# EAGLE design board (EAGLE 6.6.0)
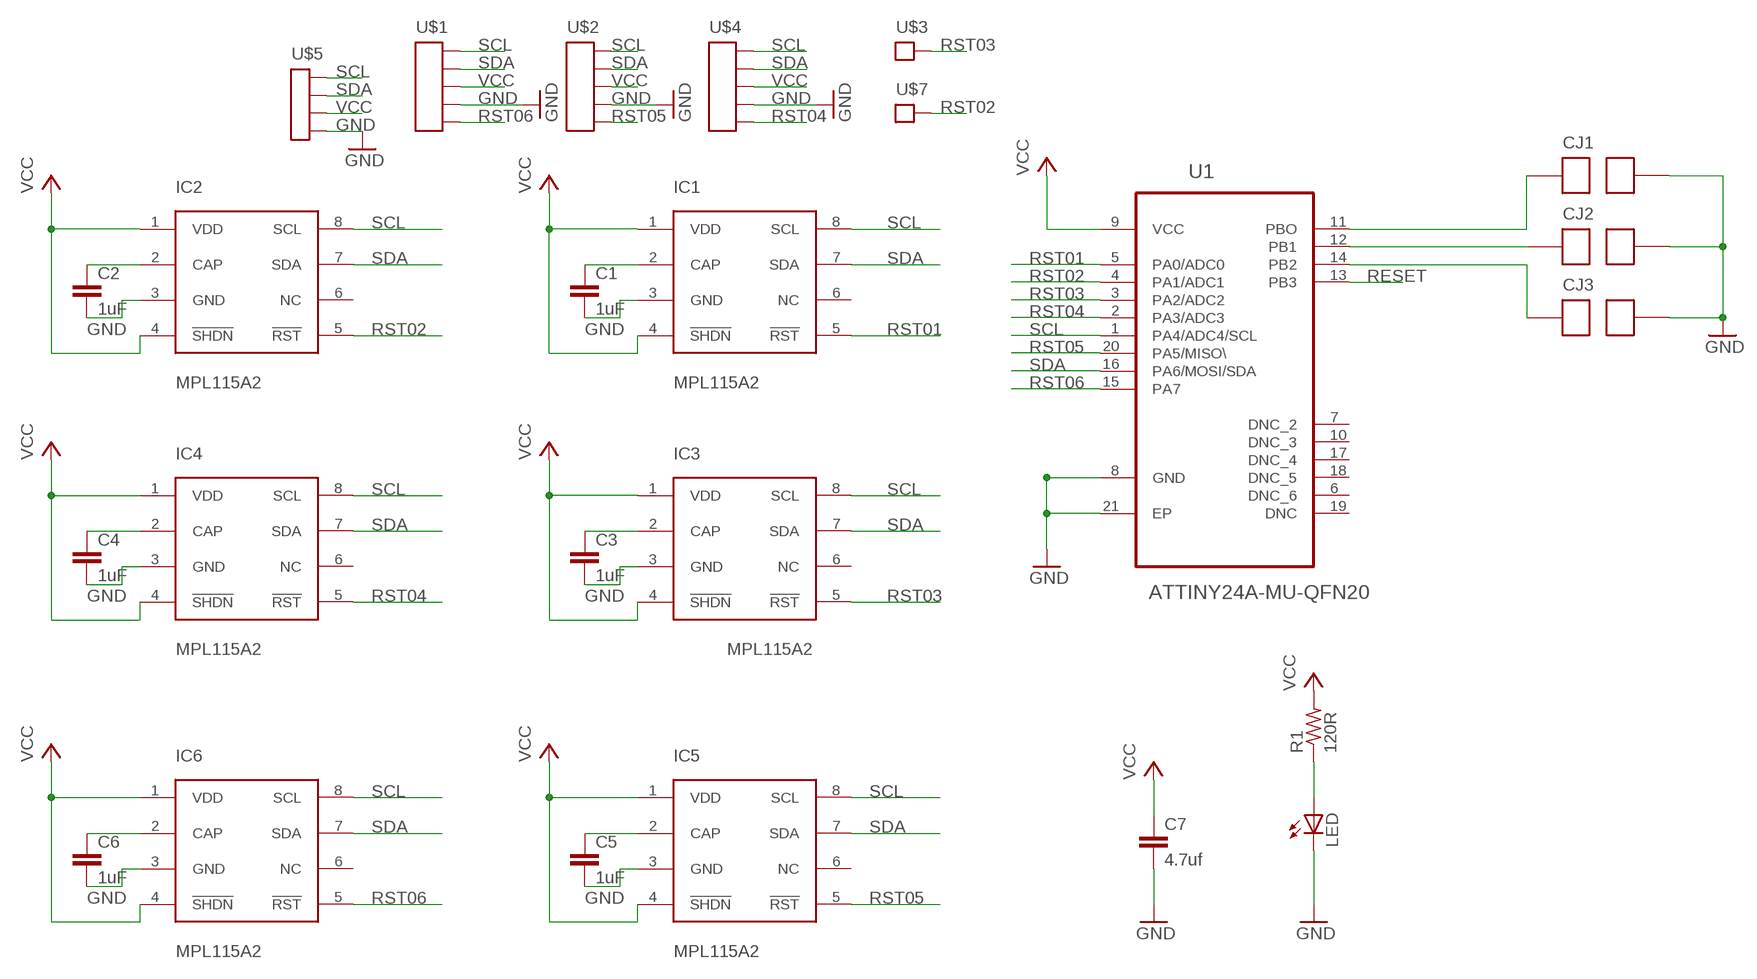
[diagram p0: schematic, sheet 1]

## Parts
C1  1uF  C-EUC0402  [C0402]
C2  1uF  C-EUC0402  [C0402]
C3  1uF  C-EUC0402  [C0402]
C4  1uF  C-EUC0402  [C0402]
C5  1uF  C-EUC0402  [C0402]
C6  1uF  C-EUC0402  [C0402]
C7  4.7uf  C-EUC0402  [C0402]
CJ1  2_P  [2_P]
CJ2  2_P  [2_P]
CJ3  2_P  [2_P]
IC1  MPL115A2  [MPL115A2]
IC2  MPL115A2  [MPL115A2]
IC3  MPL115A2  [MPL115A2]
IC4  MPL115A2  [MPL115A2]
IC5  MPL115A2  [MPL115A2]
IC6  MPL115A2  [MPL115A2]
LED  LEDSML0603  [SML0603]
R1  120R  R-US_R0402  [R0402]
U1  ATTINY24A-MU-QFN20  ATTINY24A-MU  [QFN50P400X400X80-21N]
U$1  5_PIN_CON  [5_PIN_CON]
U$2  5_PIN_CON  [5_PIN_CON]
U$3  1_PIN_CON  [1_PIN_CON]
U$4  5_PIN_CON  [5_PIN_CON]
U$5  4_PIN_CON  [4_PIN_CON]
U$7  1_PIN_CON  [1_PIN_CON]

## Nets
GND: C1.2 C2.2 C3.2 C4.2 C5.2 C6.2 C7.2 CJ1.P$2 CJ2.P$2 CJ3.P$2 IC1.3(GND) IC2.3(GND) IC3.3(GND) IC4.3(GND) IC5.3(GND) IC6.3(GND) LED.C U1.8(GND) U1.21(EP) U$1.4(GND) U$2.4(GND) U$4.4(GND) U$5.4(GND)
N$1: C1.1 IC1.2(CAP)
N$2: C5.1 IC5.2(CAP)
N$3: C2.1 IC2.2(CAP)
N$4: C6.1 IC6.2(CAP)
N$5: C3.1 IC3.2(CAP)
N$6: CJ3.P$1 U1.14(PB2)
N$7: C4.1 IC4.2(CAP)
N$8: CJ2.P$1 U1.12(PB1)
N$9: CJ1.P$1 U1.11(PBO)
N$11: LED.A R1.1
RESET: U1.13(PB3)
RST01: IC1.5(!RST) U1.5(PA0/ADC0)
RST02: IC2.5(!RST) U1.4(PA1/ADC1) U$7.1(RTS)
RST03: IC3.5(!RST) U1.3(PA2/ADC2) U$3.1(RTS)
RST04: IC4.5(!RST) U1.2(PA3/ADC3) U$4.5(RST)
RST05: IC5.5(!RST) U1.20(PA5/MISO\) U$2.5(RST)
RST06: IC6.5(!RST) U1.15(PA7) U$1.5(RST)
SCL: IC1.8(SCL) IC2.8(SCL) IC3.8(SCL) IC4.8(SCL) IC5.8(SCL) IC6.8(SCL) U1.1(PA4/ADC4/SCL) U$1.1(CLK) U$2.1(CLK) U$4.1(CLK) U$5.1(CLK)
SDA: IC1.7(SDA) IC2.7(SDA) IC3.7(SDA) IC4.7(SDA) IC5.7(SDA) IC6.7(SDA) U1.16(PA6/MOSI/SDA) U$1.2(DATA) U$2.2(DATA) U$4.2(DATA) U$5.2(DATA)
VCC: C7.1 IC1.1(VDD) IC1.4(!SHDN) IC2.1(VDD) IC2.4(!SHDN) IC3.1(VDD) IC3.4(!SHDN) IC4.1(VDD) IC4.4(!SHDN) IC5.1(VDD) IC5.4(!SHDN) IC6.1(VDD) IC6.4(!SHDN) R1.2 U1.9(VCC) U$1.3(VCC) U$2.3(VCC) U$4.3(VCC) U$5.3(VCC)
Unconnected: IC1.6(NC) IC2.6(NC) IC3.6(NC) IC4.6(NC) IC5.6(NC) IC6.6(NC) U1.6(DNC_6) U1.7(DNC_2) U1.10(DNC_3) U1.17(DNC_4) U1.18(DNC_5) U1.19(DNC)

## Library data of the parts
C1-C7 = rcl:C-EU: CAPACITOR, European symbol
CJ1-CJ3 = 20_d:2_P
IC1-IC6 = MPL115A2:MPL115A2
LED = led:LED: LED OSRAM: - CHIPLED LG R971, LG N971, LY N971, LG Q971, LY Q971, LO R971, LY R971 LH N974, LH R974 LS Q976, LO Q976, LY Q976 LO Q996 - Hyper CHIPLED LW Q18S LB Q993, LB Q99A, LB R99A - SideLED LS A670, LO A670, LY A670, LG A670, LP A670 LB A673, LV A673, LT A673, LW A673 LH A674 LY A675 LS A676, LA A676, LO A676, LY A676, LW A676 LS A679, LY A679, LG A679 - Hyper Micro SIDELED® LS Y876, LA Y876, LO Y876, LY Y876 LT Y87S - SmartLED LW L88C, LW L88S LB L89C, LB L89S, LG L890 LS L89K, LO L89K, LY L89K LS L896, LA L896, LO L896, LY L896 - TOPLED LS T670, LO T670, LY T670, LG T670, LP T670 LSG T670, LSP T670, LSY T670, LOP T670, LYG T670 LG T671, LOG T671, LSG T671 LB T673, LV T673, LT T673, LW T673 LH T674 LS T676, LA T676, LO T676, LY T676, LB T676, LH T676, LSB T676, LW T676 LB T67C, LV T67C, LT T67C, LS T67K, LO T67K, LY T67K, LW E67C LS E67B, LA E67B, LO E67B, LY E67B, LB E67C, LV E67C, LT E67C LW T67C LS T679, LY T679, LG T679 LS T770, LO T770, LY T770, LG T770, LP T770 LB T773, LV T773, LT T773, LW T773 LH T774 LS E675, LA E675, LY E675, LS T675 LS T776, LA T776, LO T776, LY T776, LB T776 LHGB T686 LT T68C, LB T68C - Hyper Mini TOPLED® LB M676 - Mini TOPLED Santana® LG M470 LS M47K, LO M47K, LY M47K Source: http://www.osram.convergy.de LUXEON: - LUMILED® LXK2-PW12-R00, LXK2-PW12-S00, LXK2-PW14-U00, LXK2-PW14-V00 LXK2-PM12-R00, LXK2-PM12-S00, LXK2-PM14-U00 LXK2-PE12-Q00, LXK2-PE12-R00, LXK2-PE12-S00, LXK2-PE14-T00, LXK2-PE14-U00 LXK2-PB12-K00, LXK2-PB12-L00, LXK2-PB12-M00, LXK2-PB14-N00, LXK2-PB14-P00, LXK2-PB14-Q00 LXK2-PR12-L00, LXK2-PR12-M00, LXK2-PR14-Q00, LXK2-PR14-R00 LXK2-PD12-Q00, LXK2-PD12-R00, LXK2-PD12-S00 LXK2-PH12-R00, LXK2-PH12-S00 LXK2-PL12-P00, LXK2-PL12-Q00, LXK2-PL12-R00 Source: www.luxeon.com KINGBRIGHT: KA-3528ASYC Source: www.kingbright.com
R1 = rcl:R-US_: RESISTOR, American symbol
U1 = ATTINY:ATTINY24A-MU: Microcontroller; MPN: ATTINY24A-MU; OC_FARNELL: 1748542; OC_NEWARK: 26R5649; PACKAGE: QFN-20; SUPPLIER: Atmel
U$1 U$2 U$4 = board:5_PIN_CON
U$3 U$7 = board:1_PIN_CON
U$5 = board:4_PIN_CON

## Net classes
0 default: clearance 0.355 mm

## Board
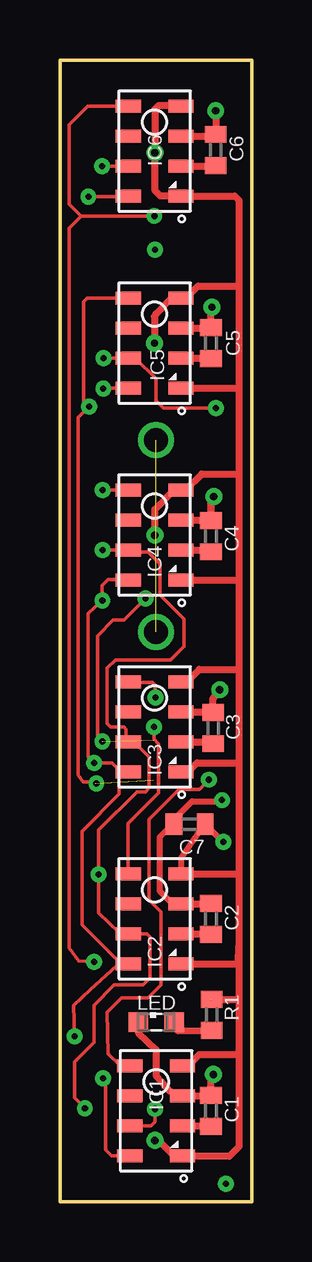
[diagram p1: board, top side]
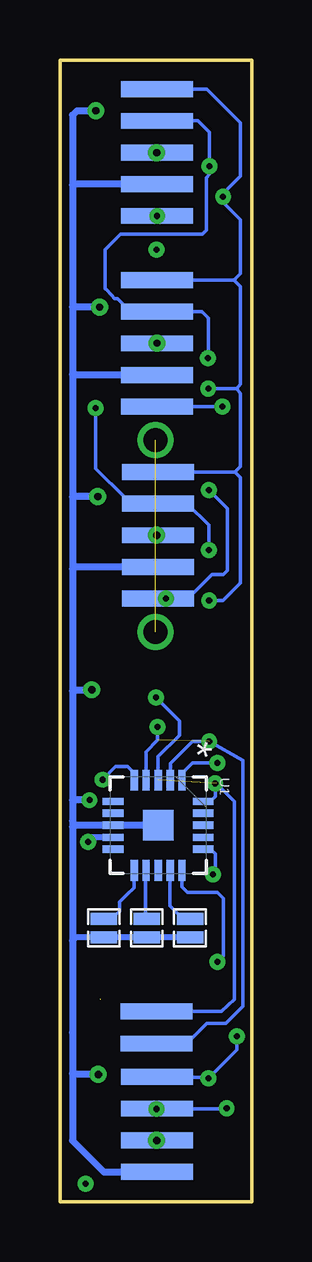
[diagram p2: board, bottom side, seen from below]

Size 8 x 47.6 mm. Coordinates in mm from the lower left corner, seen from the top.
Outline: 0,0 8,0 8,47.6 0,47.6 0,0
Copper layers (1*16): Top 0.035559375mm / dielectric 1.501140625mm / Bottom 0.035559375mm
Design rules "default": minimum track width 5mil, minimum drill 10mil, track to track 5mil, track to pad 5mil, pad to pad 5mil, via to via 6mil, smd to smd 5mil, copper to edge 15mil, drill to drill 8mil, minimum pad ring 10mil, minimum via ring 8mil, stop-mask expansion 2mil, vias tented up to drill 100mil, thermal gap 10mil

### Footprints (pad centres in the part's own frame; a part is rotated, then mirrored left to right if it is on the bottom)
C0402 = smd 0.7 x 0.9: 1 -0.65,0; 2 0.65,0
2_P = smd 1.1 x 0.5: P$1 0,0; P$2 0,0.775
MPL115A2 = smd 1.05 x 0.55: 1 -1.1,3.075; 2 -1.1,1.825; 3 -1.1,0.575; 4 -1.1,-0.675; 5 1.1,-0.675; 6 1.1,0.575; 7 1.1,1.825; 8 1.1,3.075
SML0603 = smd 0.8 x 0.8: A 0.75,0; C -0.75,0
R0402 = smd 0.7 x 0.9: 1 -0.65,0; 2 0.65,0
QFN50P400X400X80-21N = smd 0.864 x 0.305: 1 -1.88,0.991; 2 -1.88,0.508; 3 -1.88,0; 4 -1.88,-0.508; 5 -1.88,-0.991; 11 1.88,-0.991; 12 1.88,-0.508; 13 1.88,0; 14 1.88,0.508; 15 1.88,0.991 | smd 0.305 x 0.864: 6 -0.991,-1.88; 7 -0.508,-1.88; 8 0,-1.88; 9 0.508,-1.88; 10 0.991,-1.88; 16 0.991,1.88; 17 0.508,1.88; 18 0,1.88; 19 -0.508,1.88; 20 -0.991,1.88 | smd 1.27 x 1.27: 21 0,0
5_PIN_CON = smd 3 x 0.66: 1 0,5.28; 2 0,3.96; 3 0,2.64; 4 0,1.32; 5 0,0
1_PIN_CON = smd 3 x 0.66: 1 0,0
4_PIN_CON = smd 3 x 0.66: 1 0,3.96; 2 0,2.64; 3 0,1.32; 4 0,0

### Placement (x,y rotation side)
C1  6.3,3.8 90 top
C2  6.3,11.8 90 top
C3  6.4,19.75 90 top
C4  6.3,27.75 90 top
C5  6.3,35.8 90 top
C6  6.5,43.85 90 top
C7  5.41,15.75 180 top
CJ1  6.17,11.8 180 bottom
CJ2  4.37,11.8 180 bottom
CJ3  2.57,11.8 180 bottom
IC1  4.02,5 180 top
IC2  3.95,13 180 top
IC3  3.95,21 180 top
IC4  3.95,29 180 top
IC5  3.95,37 180 top
IC6  3.95,45 180 top
LED  4.02,7.5 0 top
R1  6.33,7.8 90 top
U1  3.9,15.7 270 bottom
U$1  3.95,41.1 0 bottom
U$2  3.95,33.15 0 bottom
U$3  3.97,7.95 0 bottom
U$4  3.9,25.15 0 bottom
U$5  3.95,1.25 0 bottom
U$7  3.97,6.6 0 bottom

### Tracks (layer width: path | path; a pad name or v marks a point on that pad's centre or on a via)
GND  (via drill 0.25, 0.3)
  Top 0.15: 4.62,4.6 4.94,4.6 IC1.3
  Top 0.25: 4.69,12.43 4.17,12.95 4.17,15.21 4.18,15.21 4.82,15.85 | 4.82,15.85 4.82,16 5.52,16.7 6.72,16.7 v6.77,16.75 | 4.82,15.85 4.82,15.81 C7.2
  Top 0.3: 6.42,44.42 6.5,44.35 | 6.32,28.43 C4.2 | 6.32,20.43 C3.2 6.38,20.43 | 6.32,20.43 6.38,20.43 | 6.38,20.43 6.5,20.43 | 6.32,28.43 6.47,28.43 | v6.5,45.48 C6.2 6.42,44.42 | IC6.3 6.42,44.42 | IC5.3 6.27,36.42 C5.2 6.3,37.16 v6.34,37.3 | 6.32,28.43 6.32,29.3 | 6.32,29.3 v6.42,29.4 | IC4.3 6.27,28.43 C4.2 | C4.2 6.3,29.28 6.32,29.3 | IC3.3 6.32,20.43 | 6.38,20.43 6.38,20.95 v6.67,21.35 | IC1.3 6.27,4.42 C1.2 6.3,5.21 v6.4,5.31 | C2.2 6.32,12.43 IC2.3 4.69,12.43 | LED.C 3.27,7.05 4.02,6.35 4.02,5.25 4.62,4.6
  Top 0.406: 6.5,44.42 C6.2
  Bottom 0.25: CJ3.P$2 CJ2.P$2 CJ1.P$2 7.33,11.03 7.47,10.89
  Bottom 0.3: v6.5,45.48 v6.49,45.47 7.3,45.47 7.47,45.3 7.47,42.4 | U$1.4 7.45,42.42 7.47,42.4 | U$2.4 7.44,34.47 7.47,34.5 | U$5.4 6.17,1.25 7.47,2.55 7.47,5.35 | v6.4,5.31 7.43,5.31 7.47,5.35 | 7.47,42.4 7.47,37.3 | 7.47,37.3 7.47,34.5 | 7.47,34.5 7.47,29.4 | 7.47,29.4 7.47,26.4 | 7.47,26.4 7.47,21.3 | 7.47,21.3 7.47,16.75 | 7.47,16.75 7.47,15.9 | 7.47,15.9 7.47,15.65 | 7.47,15.65 7.47,10.89 7.47,7.05 | 7.47,7.05 7.47,5.35 | 7.45,7.07 7.47,7.05 | 7.45,15.88 7.47,15.9 | U$4.4 7.4,26.47 7.47,26.4 | v6.42,29.4 7.47,29.4 | v6.34,37.3 7.47,37.3 | 7.47,21.3 7.42,21.35 v6.67,21.35 | U1.21 U1.8 7.42,15.7 7.47,15.65 | v6.77,16.75 7.47,16.75
  pour Top: -0.08,47.6 -0.08,47.55 0.07,47.55
N$1
  Top 0.3: IC1.2 6.27,3.17 C1.1
N$2
  Top 0.3: IC5.2 6.27,35.17 C5.1
N$3
  Top 0.3: IC2.2 6.27,11.18 C2.1
N$4
  Top 0.3: IC6.2 6.47,43.17 C6.1
N$5
  Top 0.3: IC3.2 6.27,19.18 C3.1
N$6
  Bottom 0.15: U1.14 3.41,12.89 3.41,12.34 2.87,11.8 CJ3.P$1
N$7
  Top 0.3: IC4.2 6.27,27.18 C4.1
N$8
  Bottom 0.15: U1.12 4.42,11.85 CJ2.P$1
N$9
  Bottom 0.15: U1.11 4.91,13.09 5.22,12.8 5.52,12.5 5.52,12.11 5.67,11.96 5.99,11.96 CJ1.P$1
N$10  (via drill 0.25)
  other vias: 3.97,39.7
N$11
  Top 0.15: LED.A 4.92,7.14
  Top 0.3: 4.92,7.14 R1.1
N$12  (via drill 1)  (1 unrouted)
  other vias: 4.02,31.75 4.02,23.75
N$13  (via drill 0.25)
  other vias: 6.92,0.75
RST01  (via drill 0.25)
  Top 0.15: 2.85,5.67 IC1.5 2.52,5.67 2.52,5.7 2.02,6.17 1.97,7.9 2.57,8.5 3.67,8.5 4.22,9.05 4.22,12.1 3.72,12.6 3.72,15.95 4.97,17.2 5.82,17.2 v6.22,17.6
  Bottom 0.15: U1.5 4.89,17.87 5.17,18.15 5.67,18.15 v6.22,17.6
RST02  (via drill 0.25)  (1 unrouted)
  Top 0.15: v3.92,19.8 3.92,19.3 4.12,19.1 4.12,17.05 2.85,15.78 IC2.5
  Bottom 0.15: U$7.1 2.72,6.6 1.87,7.45 1.07,7.45 0.37,8.15 0.37,18.4 1.77,19.2 | U1.4 4.41,18.76 3.92,19.25 v3.92,19.8 3.92,19.85
RST03  (via drill 0.25)  (1 unrouted)
  Top 0.15: 2.59,21.65 3.87,21.65 3.97,21.55 3.97,21.05 v4,21.02
  Top 0.2: IC3.5 2.83,21.65 2.59,21.65
  Bottom 0.15: U$3.1 1.27,7.95 0.72,8.45 0.72,16.7 1.47,17.45 | 3.97,21 v4,21.02 | 4.02,21.05 v4,21.02 | v4,21.02 3.02,20.05 3.02,19.45 3.9,18.57 U1.3
RST04  (via drill 0.25)
  Top 0.15: IC4.5 v1.78,29.68 | v1.77,19.2 1.77,19.25 1.57,19.45 1.57,23.6 2.22,24.25 2.67,24.25 v3.57,25.15
  Bottom 0.15: U$4.5 v3.57,25.15 | v3.57,25.15 2.65,25.15 | 2.65,25.15 1.65,26.15 1.17,26.15 1.01,26.31 1.01,28.91 v1.78,29.68 | U$4.5 3.94,25.15 3.96,25.13 | 2.65,25.15 2.65,25.03 | U1.2 3.39,18.28 2.47,19.2 v1.77,19.2 | v3.57,25.15 3.57,25.17 U$4.5
RST05  (via drill 0.25)
  Top 0.15: IC5.5 1.14,37.67 0.99,37.52 0.99,33.38 v1.22,33.15 | 0.97,32.9 v1.22,33.15 | v1.22,33.15 0.77,32.7 0.77,17.8 0.97,17.5 1.47,17.5 v1.52,17.45
  Bottom 0.15: U$2.5 v1.22,33.15 | U1.20 1.73,16.69 1.52,16.9 v1.52,17.45
RST06  (via drill 0.25)
  Top 0.15: IC6.5 1.16,45.68 0.38,44.9 0.38,41.6 0.88,41.1 | v1.42,10 0.78,10.05 0.38,10.6 0.38,40.6 0.88,41.1 | v3.94,41.1 0.88,41.1
  Bottom 0.15: 3.97,41.08 U$1.5 3.95,41.07 v3.94,41.1 | U1.15 2.91,13.14 2.67,12.9 1.42,12.9 1.17,12.65 1.17,10.25 v1.42,10
SCL  (via drill 0.25)
  Top 0.15: 2.84,33.9 2.83,33.9 IC5.8 1.83,33.92 v1.81,33.9 | 2.83,41.9 v1.19,41.9 | 2.51,25.81 2.51,25.9 2.83,25.9 IC4.8 | IC4.8 2.56,25.93 | IC3.8 2.83,17.95 2.67,17.95 | IC1.8 2.17,1.93 1.91,2.18 1.91,5.04 v1.8,5.15 1.91,5.14 | v1.77,25.07 1.74,24.92 | 2.87,17.91 IC3.8 | IC3.8 2.67,18.1 2.37,18.1 2.17,18.3 v1.42,18.3 1.17,18.55 1.17,24.52 v1.77,25.07 | IC3.8 2.47,17.89 2.47,17 0.92,15.45 0.92,11.55 2.47,10 2.42,9.99 2.67,9.93 IC2.8 2.77,9.89 2.37,9.85 1.27,8.85 0.57,8.2 v0.62,6.9 | v1.77,25.07 1.77,25.7 2.02,25.95 2.83,25.95 IC4.8
  Top 0.2: 2.83,41.9 IC6.8
  Bottom 0.15: 3.93,46.4 U$1.1 1.87,46.38 0.47,44.98 0.47,42.75 1.19,42.03 v1.19,41.9 1.19,41.67 0.47,40.95 0.47,38.7 0.72,38.45 | U$4.1 0.7,30.43 | U$2.1 3.95,38.45 3.93,38.47 U$2.1 0.75,38.42 0.72,38.45 | 3.97,5.23 U$5.1 3.86,5.3 2.77,5.3 2.67,5.2 1.85,5.2 v1.8,5.15 0.62,6.33 v0.62,6.9 | U1.1 2.91,17.87 2.48,18.3 v1.42,18.3 | 0.72,38.45 0.7,38.4 0.7,38.38 0.47,38.15 0.47,34.1 0.62,33.9 | 0.62,33.9 v1.81,33.9 v1.82,33.9 | 0.62,33.9 0.47,33.7 0.47,30.65 0.69,30.43 0.7,30.43 | v1.77,25.07 1.2,25.07 0.47,25.8 0.47,30.2 0.7,30.43
SDA  (via drill 0.25)
  Top 0.15: v1.82,35.17 1.84,35.17 IC5.7 3.14,35.17 4,34.31 4,33.41 4.32,33.09 v6.51,33.09 | IC6.7 v1.77,43.17 v1.76,43.18 | v1.78,27.18 IC4.7 2.92,27.1 3.67,27.1 4.17,26.6 4.17,25.3 5.17,24.3 5.17,23.15 4.62,22.6 2.32,22.6 1.97,22.25 1.97,19.95 2.12,19.8 2.67,19.8 2.77,19.7 2.77,19.25 IC3.7 3.1,19.18 3.72,18.55 3.72,17.25 3.57,17.1 3.22,17.1 1.62,15.5 v1.62,13.65 1.62,12.05 2.5,11.22 IC2.7 3.65,11.18 3.77,11.05 3.77,9.35 3.47,9.05 2.27,9.05 1.42,8.2 1.42,6.65 0.62,5.85 0.62,4.33 v1.04,3.9 | v1.04,3.9 1.11,3.93 0.94,3.85 v1.04,3.9 | IC1.7 3.79,3.17 3.97,3.35 v3.97,3.87
  Bottom 0.15: U$1.2 2.25,45.07 1.76,44.58 v1.76,43.18 1.76,42.83 1.89,42.7 1.89,40.5 2.05,40.34 5.47,40.34 6.11,39.7 6.11,38.07 6.08,38.04 5.84,37.79 5.71,37.66 5.6,37.66 5.31,37.37 5.31,37.2 4.04,37.2 U$2.2 2.07,37.11 1.81,36.85 v1.81,35.18 v1.82,35.17 | v6.51,33.09 6.51,30.57 5.27,29.33 4.12,29.33 U$4.2 | U$5.2 4.09,3.89 v3.97,3.87 U$5.2 1,3.88 v1.04,3.9 | v1.78,27.18 1.78,28.21 2.67,29.1 U$4.2 | U1.16 1.73,14.71 1.52,14.5 1.52,13.75 v1.62,13.65
  Bottom 0.2: U$4.2
VCC  (via drill 0.25, 0.3)  (1 unrouted)
  Top 0.15: 6.37,8.45 6.31,8.45
  Top 0.2: IC1.1 4.83,1.93
  Top 0.25: v6.82,15 v6.81,15 C7.1 5.42,14.86 5.07,14.35 5.05,14.3 IC2.4
  Top 0.3: 5.02,45.65 IC6.4 5.07,45.7 4.12,45.7 3.96,45.54 v3.96,43.74 3.95,43.78 U$1.3 3.97,43.72 3.97,42.15 4.19,41.92 IC6.1 7.29,41.92 7.47,41.75 7.47,38.25 | 5.07,25.9 IC4.1 7.44,25.93 7.47,25.95 | IC3.1 5.09,17.97 5.39,17.97 5.72,18.3 7.47,18.3 | 5.07,21.65 IC3.4 5.29,21.68 5.82,22.2 7.47,22.2 | 3.99,35.75 U$2.3 3.99,35.79 v3.95,35.8 | v3.95,35.8 v3.94,35.81 3.94,36.92 4,36.98 4,37.01 4.66,37.67 IC5.4 5.26,37.67 5.77,38.18 7.4,38.18 7.47,38.25 | U$2.3 v3.95,35.8 | 7.47,30.35 5.92,30.35 5.24,29.68 IC4.4 4.76,29.68 3.96,28.87 v3.96,27.79 | IC1.1 5.07,1.9 7.07,1.9 7.47,2.3 7.47,6.25 | IC1.4 5.34,5.67 5.82,6.15 7.37,6.15 7.47,6.25 | 4.83,1.93 4.83,1.97 4.9,2.03 4.65,2.03 4.15,2.53 4.04,2.53 v3.96,2.56 | 7.47,38.25 7.47,33.95 | 7.47,33.95 7.47,30.35 | 7.47,30.35 7.47,25.95 | 7.47,25.95 7.47,22.2 | 7.47,22.2 7.47,18.3 | 7.47,18.3 7.47,13.68 | 7.47,13.68 7.47,10.7 | 7.47,10.7 7.47,8.45 | 7.47,8.45 7.47,6.25 | IC2.1 7.44,9.93 7.47,10.7 | 6.37,8.45 7.47,8.45 | IC5.1 7.44,33.92 7.47,33.95 | IC2.4 7.47,13.68
  Bottom 0.25: U1.9 6.73,15.19 v6.82,15
  Bottom 0.3: v3.96,43.74 3.97,43.76 U$1.3 | v3.95,35.8 4,35.84 U$2.3 | U$4.3 v3.96,27.79 | U$5.3 3.93,2.57 v3.96,2.56

### Text on the board
_tsilk: 6 | C6 | Cut | Cut | 5 | C5 | Cut | Cut | 4 | C4 | Cut | Cut | 3 | C3 | C7 | 2 | LED | C2 | R1 | TakkTile | 1 | C1
_bsilk: C | C | D | D | V | V | G | G | S | S | Cut | Cut | C | C | D | D | V | V | G | G | S | S | Cut | Cut | C | C | D | D | V | V | G | G | S | S | Cut | Cut | TakkTile | 0 | 1 | 2 | address | S5 | S5 | S4 | S4 | C | C | D | D | V | V | G